# Altium schematic sheet base.SchDoc
size A3; SheetNumber: 1; SheetTotal: 1
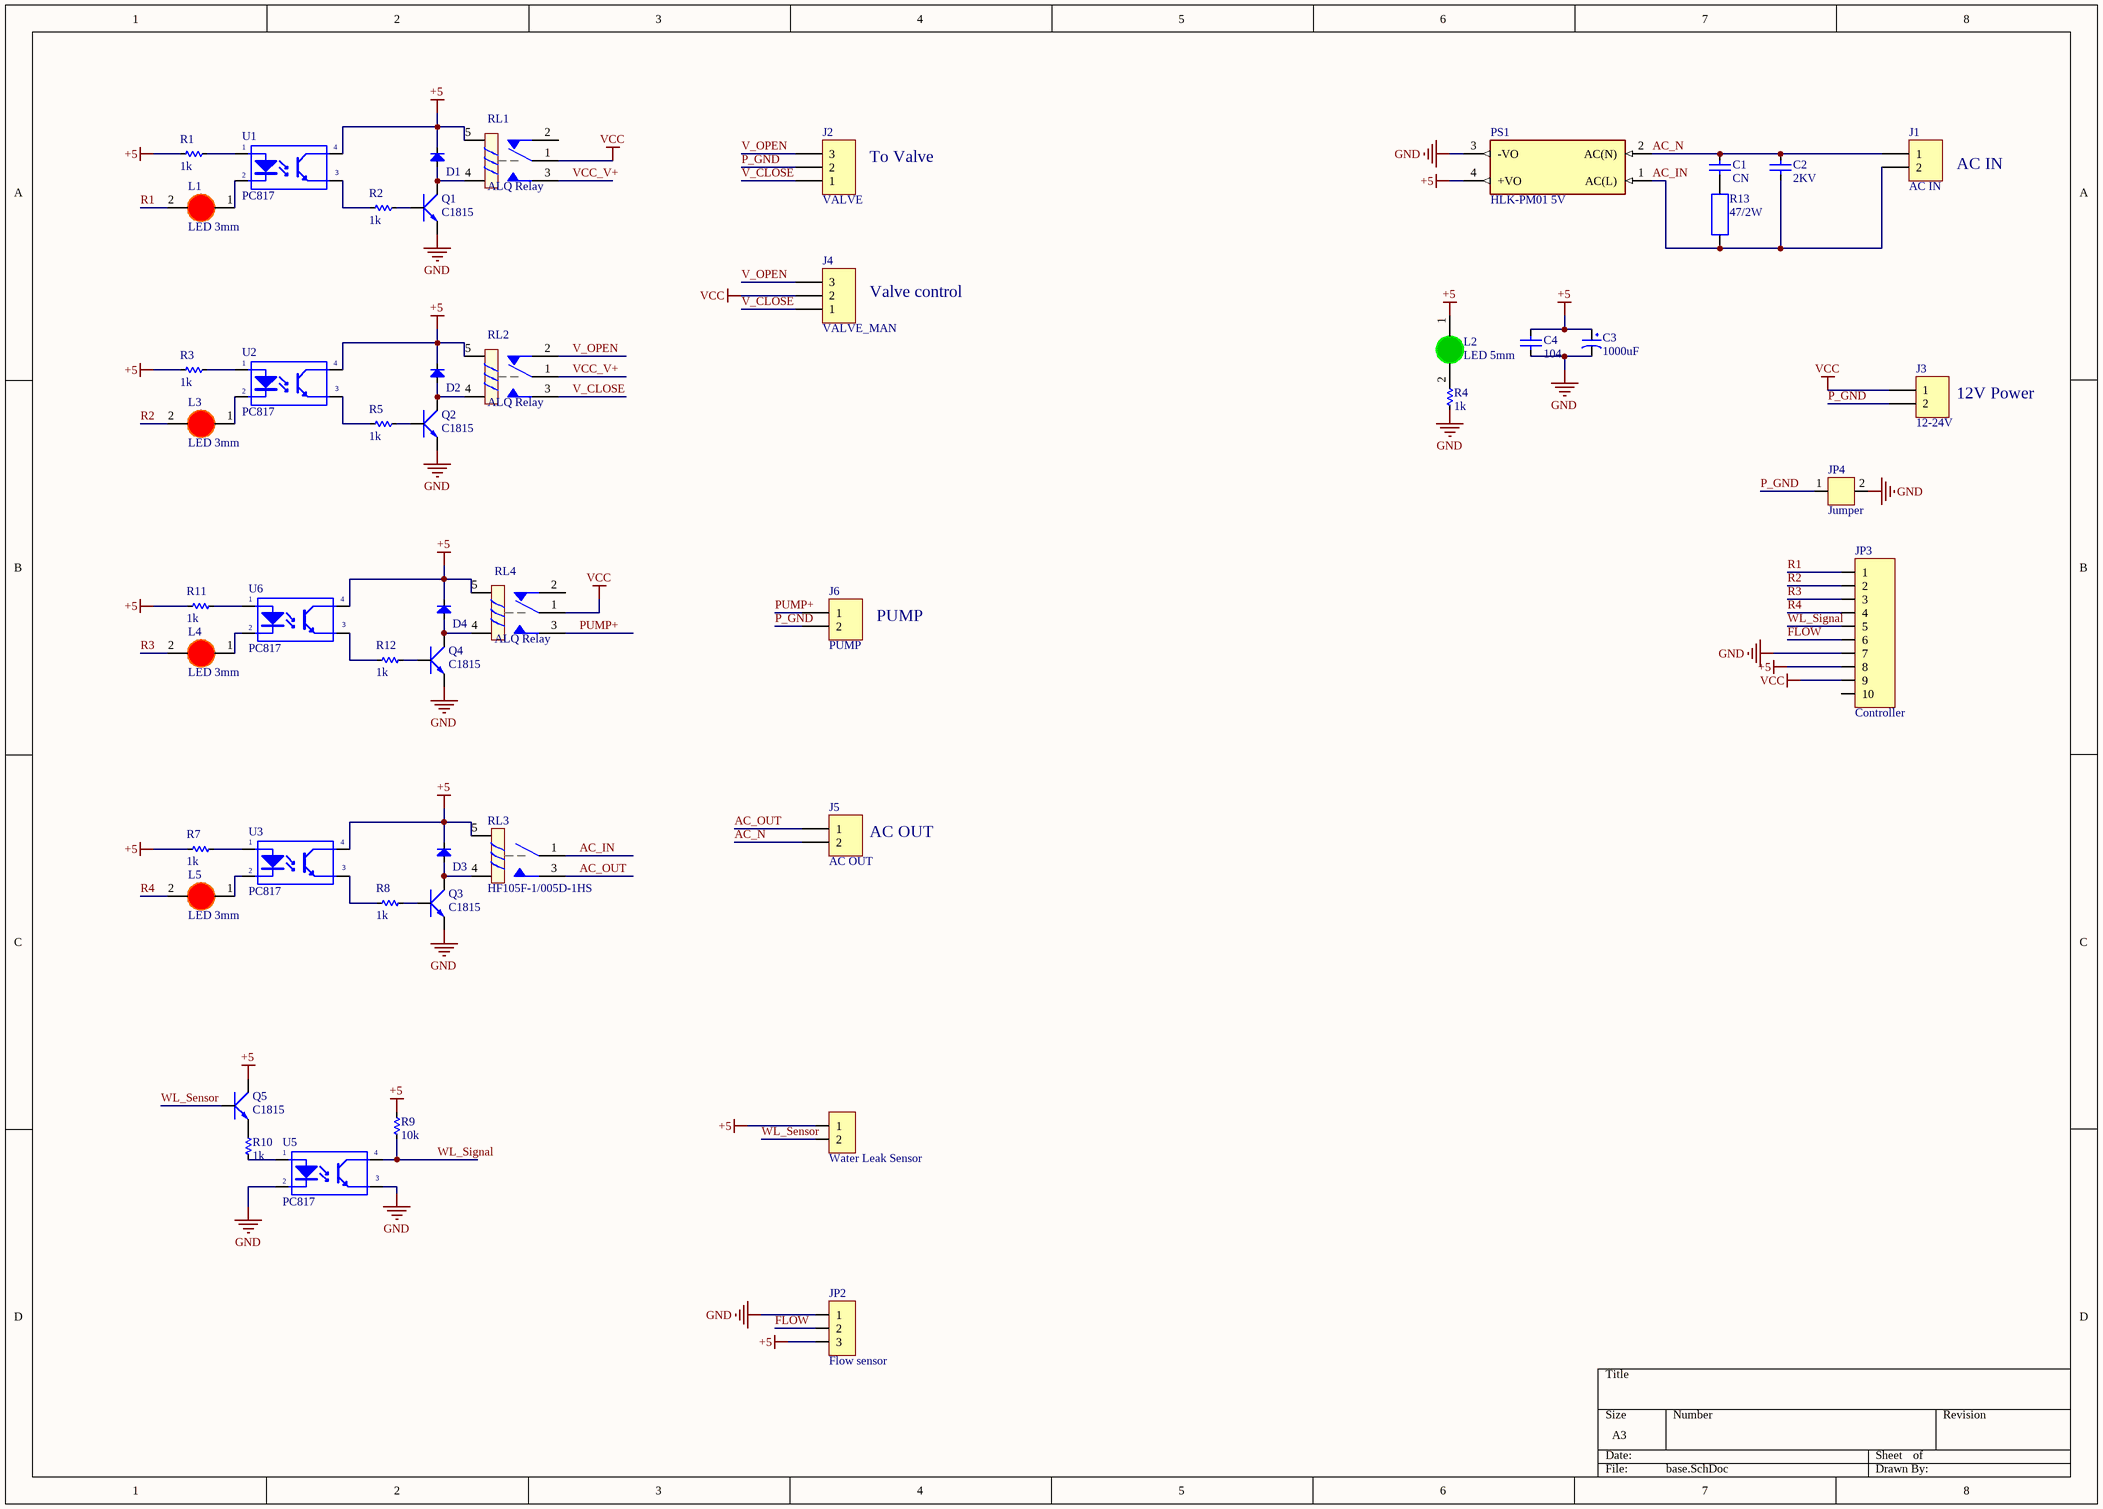
[diagram p0: base.SchDoc]

## Parts
C1  CN  [Cap 15mm]
C2  2KV  [Cap 7.5mm]
C3  1000uF  [tu hoa 8mm]
C4  104  [Cap 2.54mm]
D1  Diode  [DIO-1A]  (value not drawn)
D2  Diode  [DIO-1A]  (value not drawn)
D3  Diode  [DIO-1A]  (value not drawn)
D4  Diode  [DIO-1A]  (value not drawn)
J1  AC IN  [CON 2 2EDG5.08]
J2  VALVE  [CON 3 2EDG5.08]
J3  12-24V  [CON 2 2EDG5.08]
J4  VALVE_MAN  [CON 3 2EDG5.08]
J5  AC OUT  [CON 2 2EDG5.08]
J6  PUMP  [CON 2 2EDG5.08]
JP1  Water Leak Sensor  [JP 1x2 CT]
JP2  Flow sensor  [JP 1x3 DT]
JP3  Controller  [JP 1x10 CT]
JP4  Jumper  [Jumper 5.08]
L1  LED 3mm  [LED-3MM-RED]
L2  LED 5mm  [LED-5MM-Green]
L3  LED 3mm  [LED-3MM-RED]
L4  LED 3mm  [LED-3MM-RED]
L5  LED 3mm  [LED-3MM-RED]
PS1  HLK-PM01 5V  [CONV_HLK-PM01]
Q1  C1815  [TO92]
Q2  C1815  [TO92]
Q3  C1815  [TO92]
Q4  C1815  [TO92]
Q5  C1815  [TO92]
R1  1k  [RES-1/4W]
R2  1k  [RES-1/4W]
R3  1k  [RES-1/4W]
R4  1k  [RES-1/4W]
R5  1k  [RES-1/4W]
R7  1k  [RES-1/4W]
R8  1k  [RES-1/4W]
R9  10k  [RES-1/4WD]
R10  1k  [RES-1/4WD]
R11  1k  [RES-1/4W]
R12  1k  [RES-1/4W]
R13  47/2W  [R2WD]
RL1  ALQ Relay  [Relay-LQ-form-C]
RL2  ALQ Relay  [Relay-LQ-form-C]
RL3  HF105F-1/005D-1HS  [Relay-HF-30A-Form-A]
RL4  ALQ Relay  [Relay-LQ-form-C]
U1  PC817  [DIP4]
U2  PC817  [DIP4]
U3  PC817  [DIP4]
U5  PC817  [DIP4]
U6  PC817  [DIP4]

## Nets
+5: C3.1 C4.2 D1.2(K) D2.2(K) D3.2(K) D4.2(K) JP1.1 JP2.3 JP3.8 L2.1(A) PS1.4(+VO) Q5.2(C) R1.1 R3.1 R7.1 R9.2 R11.1 RL1.5 RL2.5 RL3.5 RL4.5 U1.4(C) U2.4(C) U3.4(C) U6.4(C)
GND: C3.2 C4.1 JP2.1 JP3.7 JP4.2 PS1.3(-VO) Q1.1(E) Q2.1(E) Q3.1(E) Q4.1(E) R4.1 U5.2(K) U5.3(E)
VCC: J3.1 J4.2 JP3.9 RL1.1 RL4.1
AC_IN: C2.2 J1.2 PS1.1(AC(L)) R13.2 RL3.1
AC_N: C1.2 C2.1 J1.1 J5.2 PS1.2(AC(N))
AC_OUT: J5.1 RL3.3
FLOW: JP2.2 JP3.6
P_GND: J2.2 J3.2 J6.2 JP4.1
PUMP+: J6.1 RL4.3
R1: JP3.1 L1.2(K)
R2: JP3.2 L3.2(K)
R3: JP3.3 L4.2(K)
R4: JP3.4 L5.2(K)
V_CLOSE: J2.1 J4.1 RL2.3
V_OPEN: J2.3 J4.3 RL2.2
VCC_V+: RL1.3 RL2.1
WL_Sensor: JP1.2 Q5.3(B)
WL_Signal: JP3.5 R9.1 U5.4(C)
NetC1_1: C1.1 R13.1
NetD1_1: D1.1(A) Q1.2(C) RL1.4
NetD2_1: D2.1(A) Q2.2(C) RL2.4
NetD3_1: D3.1(A) Q3.2(C) RL3.4
NetD4_1: D4.1(A) Q4.2(C) RL4.4
NetL1_1: L1.1(A) U1.2(K)
NetL2_2: L2.2(K) R4.2
NetL3_1: L3.1(A) U2.2(K)
NetL4_1: L4.1(A) U6.2(K)
NetL5_1: L5.1(A) U3.2(K)
NetQ1_3: Q1.3(B) R2.2
NetQ2_3: Q2.3(B) R5.2
NetQ3_3: Q3.3(B) R8.2
NetQ4_3: Q4.3(B) R12.2
NetQ5_1: Q5.1(E) R10.2
NetR1_2: R1.2 U1.1(A)
NetR2_1: R2.1 U1.3(E)
NetR3_2: R3.2 U2.1(A)
NetR5_1: R5.1 U2.3(E)
NetR7_2: R7.2 U3.1(A)
NetR8_1: R8.1 U3.3(E)
NetR10_1: R10.1 U5.1(A)
NetR11_2: R11.2 U6.1(A)
NetR12_1: R12.1 U6.3(E)

Not connected (* = marked no-connect by the designer): JP3 10; RL1 2; RL4 2

## Notes on the sheet
- (near J2) To Valve
- (near J1) AC IN
- (near J4) Valve control
- (near J3) 12V Power
- (near J6) PUMP
- (near J5) AC OUT

## Library data of the parts
C1 C4 = CN: Capacitor
C2 = Cap 103 2KV: Capacitor Ceramic 2KV
C3 = Tu Hoa 1000uF 16V 8x20: Cắm; Don_Vi: Con; So_Chan: 2; Ten_Linh_Kien: Tụ Hóa 1000uF 16V 8x20MM; Ma_Hang: MH008300; Chung_Loai: Cắm; Kieu_Chan: *
D1-D4 = Diode: Default Diode; Code - JEDEC: DO-214-AB; Value: 1N5007; Published: 8-Jun-2000; Revision: July-2002: Re-released for DXP Platform.; Publisher: Altium Limited
J1 J3 J5 J6 = CON 2 EDG5.08: CON2 KF terminal
J2 J4 = CON 3 EDG5.08: CON3 KF terminal
JP1 = JP 1x2 2.54 Cai Thang: Cắm; Ten_Linh_Kien: Jump Đơn Cái 2.54MM 1x20P Thẳng; Don_Vi: Con; Ma_Hang: MH004006; Ghi_Chu: *; Kieu_Chan: *; Chung_Loai: Cắm
JP2 = JP 1x3 2.54 Duc Thang: Cắm; Ten_Linh_Kien: Jump Đơn Đực 2.54MM 1x40P Thẳng 11MM; Don_Vi: Con; Ma_Hang: MH000903; Ghi_Chu: *; Kieu_Chan: *; Chung_Loai: Cắm
JP3 = JP 1x10 2.54 Cai Thang: Cắm; Ten_Linh_Kien: Jump Đơn Cái 2.54MM 1x20P Thẳng; Don_Vi: Con; Ma_Hang: MH004006; Ghi_Chu: *; Kieu_Chan: *; Chung_Loai: Cắm
JP4 = Jumper: jump 2.54 jump 5.08
L1 L3-L5 = LED 3mm Do: Cắm; Don_Vi: Con; Ma_Hang: MH003892; Ten_Linh_Kien: Led 3MM Phủ Đỏ (10c); Ghi_Chu: *; Kieu_Chan: *; Chung_Loai: Cắm
L2 = LED 5mm Xanh La: Cắm; Don_Vi: Con; Ma_Hang: MH008969; Ten_Linh_Kien: LED 5MM Phủ Xanh (1000c); Ghi_Chu: *; Kieu_Chan: *; Chung_Loai: Cắm
PS1 = CONV HLK-PM01: 220VAC to 5V 3W; MF: Hi-link; MP: HLK-20M12; Check_prices: https://www.snapeda.com/parts/HLK-20M12/Hi-link/view-part/?ref=eda; SnapEDA_Link: https://www.snapeda.com/parts/HLK-20M12/Hi-link/view-part/?ref=snap; Availability: Not in stock; Price: None; Value: *; Package: Non-Standard Hi-link
Q1-Q5 = Trans C1815 DIP: NPN transistor; Value: C9014
R1-R5 R7-R12 = Res: Manufacturer: Generic Components; Class: Passive; SubClass: R; Published: 08/06/2000; Publisher: Altium Hobart Technology Centre
R13 = R2W: Resistor 2W; Value: R2W - 47
RL1 RL2 RL4 = Relay Panasonic LQ: ALQ Relay 10A; ComponentLink1Description: Datasheet; ComponentLink1URL: https://api.pim.na.industrial.panasonic.com/file_stream/main/fileversion/306
RL3 = Relay 30A 4P: Relay hongfa 30A 4P HF105F-1/005D-1HS
U1-U3 U5 U6 = PC817: Single Opto; Value: PC817